# Altium schematic sheet Chess Clock Front Display SCH.SchDoc
size A3
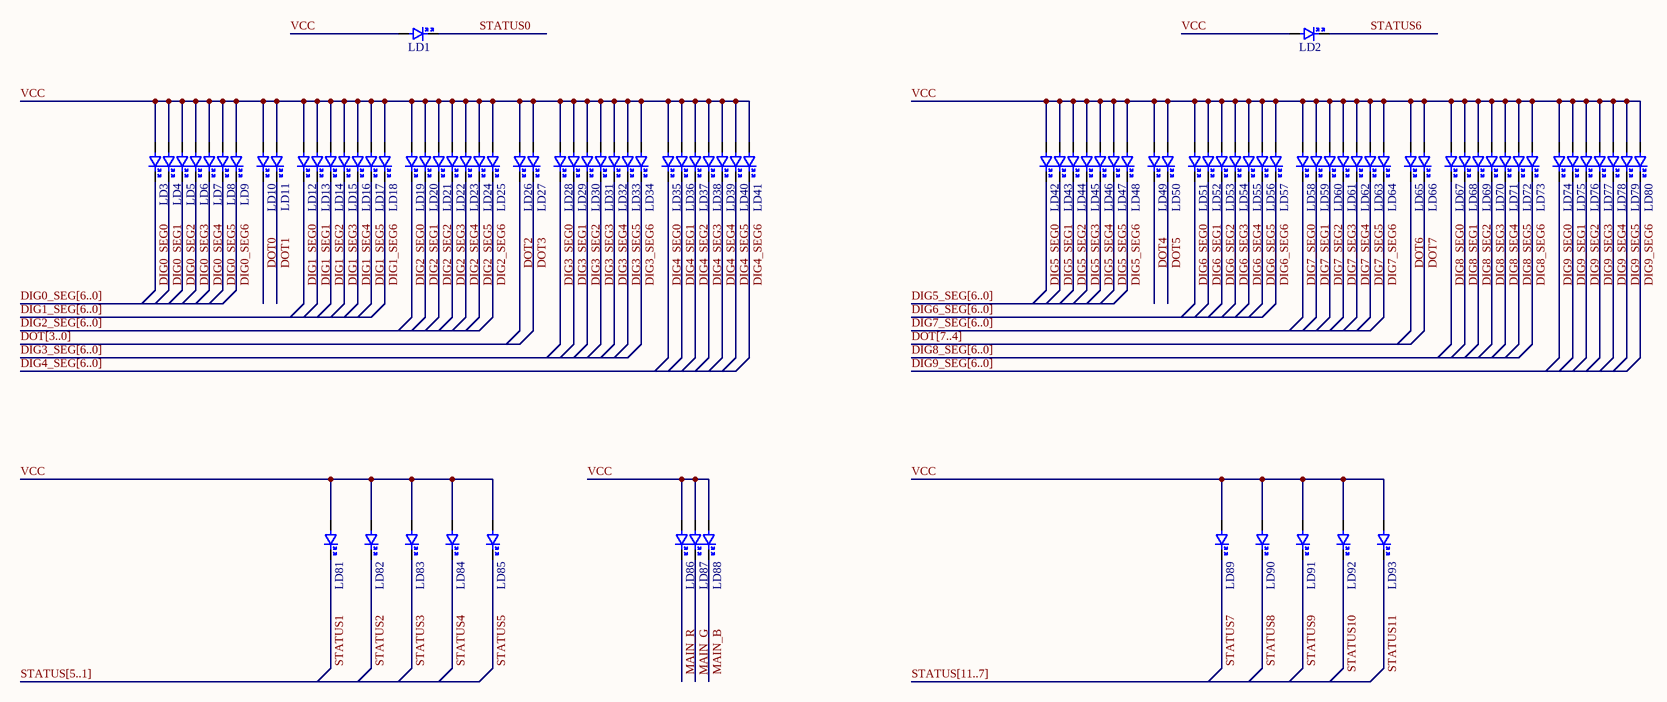
[diagram p0: Chess Clock Front Display SCH.SchDoc]

## Parts
LD1  LED 0603  [LED 0603]  (value not drawn)
LD2  LED 0603  [LED 0603]  (value not drawn)
LD3  LED 0603  [LED 0603]  (value not drawn)
LD4  LED 0603  [LED 0603]  (value not drawn)
LD5  LED 0603  [LED 0603]  (value not drawn)
LD6  LED 0603  [LED 0603]  (value not drawn)
LD7  LED 0603  [LED 0603]  (value not drawn)
LD8  LED 0603  [LED 0603]  (value not drawn)
LD9  LED 0603  [LED 0603]  (value not drawn)
LD10  LED 0603  [LED 0603]  (value not drawn)
LD11  LED 0603  [LED 0603]  (value not drawn)
LD12  LED 0603  [LED 0603]  (value not drawn)
LD13  LED 0603  [LED 0603]  (value not drawn)
LD14  LED 0603  [LED 0603]  (value not drawn)
LD15  LED 0603  [LED 0603]  (value not drawn)
LD16  LED 0603  [LED 0603]  (value not drawn)
LD17  LED 0603  [LED 0603]  (value not drawn)
LD18  LED 0603  [LED 0603]  (value not drawn)
LD19  LED 0603  [LED 0603]  (value not drawn)
LD20  LED 0603  [LED 0603]  (value not drawn)
LD21  LED 0603  [LED 0603]  (value not drawn)
LD22  LED 0603  [LED 0603]  (value not drawn)
LD23  LED 0603  [LED 0603]  (value not drawn)
LD24  LED 0603  [LED 0603]  (value not drawn)
LD25  LED 0603  [LED 0603]  (value not drawn)
LD26  LED 0603  [LED 0603]  (value not drawn)
LD27  LED 0603  [LED 0603]  (value not drawn)
LD28  LED 0603  [LED 0603]  (value not drawn)
LD29  LED 0603  [LED 0603]  (value not drawn)
LD30  LED 0603  [LED 0603]  (value not drawn)
LD31  LED 0603  [LED 0603]  (value not drawn)
LD32  LED 0603  [LED 0603]  (value not drawn)
LD33  LED 0603  [LED 0603]  (value not drawn)
LD34  LED 0603  [LED 0603]  (value not drawn)
LD35  LED 0603  [LED 0603]  (value not drawn)
LD36  LED 0603  [LED 0603]  (value not drawn)
LD37  LED 0603  [LED 0603]  (value not drawn)
LD38  LED 0603  [LED 0603]  (value not drawn)
LD39  LED 0603  [LED 0603]  (value not drawn)
LD40  LED 0603  [LED 0603]  (value not drawn)
LD41  LED 0603  [LED 0603]  (value not drawn)
LD42  LED 0603  [LED 0603]  (value not drawn)
LD43  LED 0603  [LED 0603]  (value not drawn)
LD44  LED 0603  [LED 0603]  (value not drawn)
LD45  LED 0603  [LED 0603]  (value not drawn)
LD46  LED 0603  [LED 0603]  (value not drawn)
LD47  LED 0603  [LED 0603]  (value not drawn)
LD48  LED 0603  [LED 0603]  (value not drawn)
LD49  LED 0603  [LED 0603]  (value not drawn)
LD50  LED 0603  [LED 0603]  (value not drawn)
LD51  LED 0603  [LED 0603]  (value not drawn)
LD52  LED 0603  [LED 0603]  (value not drawn)
LD53  LED 0603  [LED 0603]  (value not drawn)
LD54  LED 0603  [LED 0603]  (value not drawn)
LD55  LED 0603  [LED 0603]  (value not drawn)
LD56  LED 0603  [LED 0603]  (value not drawn)
LD57  LED 0603  [LED 0603]  (value not drawn)
LD58  LED 0603  [LED 0603]  (value not drawn)
LD59  LED 0603  [LED 0603]  (value not drawn)
LD60  LED 0603  [LED 0603]  (value not drawn)
LD61  LED 0603  [LED 0603]  (value not drawn)
LD62  LED 0603  [LED 0603]  (value not drawn)
LD63  LED 0603  [LED 0603]  (value not drawn)
LD64  LED 0603  [LED 0603]  (value not drawn)
LD65  LED 0603  [LED 0603]  (value not drawn)
LD66  LED 0603  [LED 0603]  (value not drawn)
LD67  LED 0603  [LED 0603]  (value not drawn)
LD68  LED 0603  [LED 0603]  (value not drawn)
LD69  LED 0603  [LED 0603]  (value not drawn)
LD70  LED 0603  [LED 0603]  (value not drawn)
LD71  LED 0603  [LED 0603]  (value not drawn)
LD72  LED 0603  [LED 0603]  (value not drawn)
LD73  LED 0603  [LED 0603]  (value not drawn)
LD74  LED 0603  [LED 0603]  (value not drawn)
LD75  LED 0603  [LED 0603]  (value not drawn)
LD76  LED 0603  [LED 0603]  (value not drawn)
LD77  LED 0603  [LED 0603]  (value not drawn)
LD78  LED 0603  [LED 0603]  (value not drawn)
LD79  LED 0603  [LED 0603]  (value not drawn)
LD80  LED 0603  [LED 0603]  (value not drawn)
LD81  LED 0603  [LED 0603]  (value not drawn)
LD82  LED 0603  [LED 0603]  (value not drawn)
LD83  LED 0603  [LED 0603]  (value not drawn)
LD84  LED 0603  [LED 0603]  (value not drawn)
LD85  LED 0603  [LED 0603]  (value not drawn)
LD86  LED 0603  [LED 0603]  (value not drawn)
LD87  LED 0603  [LED 0603]  (value not drawn)
LD88  LED 0603  [LED 0603]  (value not drawn)
LD89  LED 0603  [LED 0603]  (value not drawn)
LD90  LED 0603  [LED 0603]  (value not drawn)
LD91  LED 0603  [LED 0603]  (value not drawn)
LD92  LED 0603  [LED 0603]  (value not drawn)
LD93  LED 0603  [LED 0603]  (value not drawn)

## Nets
DIG0_SEG0: LD3.2
DIG0_SEG1: LD4.2
DIG0_SEG2: LD5.2
DIG0_SEG3: LD6.2
DIG0_SEG4: LD7.2
DIG0_SEG5: LD8.2
DIG0_SEG6: LD9.2
DIG1_SEG0: LD12.2
DIG1_SEG1: LD13.2
DIG1_SEG2: LD14.2
DIG1_SEG3: LD15.2
DIG1_SEG4: LD16.2
DIG1_SEG5: LD17.2
DIG1_SEG6: LD18.2
DIG2_SEG0: LD19.2
DIG2_SEG1: LD20.2
DIG2_SEG2: LD21.2
DIG2_SEG3: LD22.2
DIG2_SEG4: LD23.2
DIG2_SEG5: LD24.2
DIG2_SEG6: LD25.2
DIG3_SEG0: LD28.2
DIG3_SEG1: LD29.2
DIG3_SEG2: LD30.2
DIG3_SEG3: LD31.2
DIG3_SEG4: LD32.2
DIG3_SEG5: LD33.2
DIG3_SEG6: LD34.2
DIG4_SEG0: LD35.2
DIG4_SEG1: LD36.2
DIG4_SEG2: LD37.2
DIG4_SEG3: LD38.2
DIG4_SEG4: LD39.2
DIG4_SEG5: LD40.2
DIG4_SEG6: LD41.2
DIG5_SEG0: LD42.2
DIG5_SEG1: LD43.2
DIG5_SEG2: LD44.2
DIG5_SEG3: LD45.2
DIG5_SEG4: LD46.2
DIG5_SEG5: LD47.2
DIG5_SEG6: LD48.2
DIG6_SEG0: LD51.2
DIG6_SEG1: LD52.2
DIG6_SEG2: LD53.2
DIG6_SEG3: LD54.2
DIG6_SEG4: LD55.2
DIG6_SEG5: LD56.2
DIG6_SEG6: LD57.2
DIG7_SEG0: LD58.2
DIG7_SEG1: LD59.2
DIG7_SEG2: LD60.2
DIG7_SEG3: LD61.2
DIG7_SEG4: LD62.2
DIG7_SEG5: LD63.2
DIG7_SEG6: LD64.2
DIG8_SEG0: LD67.2
DIG8_SEG1: LD68.2
DIG8_SEG2: LD69.2
DIG8_SEG3: LD70.2
DIG8_SEG4: LD71.2
DIG8_SEG5: LD72.2
DIG8_SEG6: LD73.2
DIG9_SEG0: LD74.2
DIG9_SEG1: LD75.2
DIG9_SEG2: LD76.2
DIG9_SEG3: LD77.2
DIG9_SEG4: LD78.2
DIG9_SEG5: LD79.2
DIG9_SEG6: LD80.2
DOT0: LD10.2
DOT1: LD11.2
DOT2: LD26.2
DOT3: LD27.2
DOT4: LD49.2
DOT5: LD50.2
DOT6: LD65.2
DOT7: LD66.2
MAIN_B: LD88.2
MAIN_G: LD87.2
MAIN_R: LD86.2
STATUS0: LD1.2
STATUS1: LD81.2
STATUS2: LD82.2
STATUS3: LD83.2
STATUS4: LD84.2
STATUS5: LD85.2
STATUS6: LD2.2
STATUS7: LD89.2
STATUS8: LD90.2
STATUS9: LD91.2
STATUS10: LD92.2
STATUS11: LD93.2
VCC: LD1.1 LD2.1 LD3.1 LD4.1 LD5.1 LD6.1 LD7.1 LD8.1 LD9.1 LD10.1 LD11.1 LD12.1 LD13.1 LD14.1 LD15.1 LD16.1 LD17.1 LD18.1 LD19.1 LD20.1 LD21.1 LD22.1 LD23.1 LD24.1 LD25.1 LD26.1 LD27.1 LD28.1 LD29.1 LD30.1 LD31.1 LD32.1 LD33.1 LD34.1 LD35.1 LD36.1 LD37.1 LD38.1 LD39.1 LD40.1 LD41.1 LD42.1 LD43.1 LD44.1 LD45.1 LD46.1 LD47.1 LD48.1 LD49.1 LD50.1 LD51.1 LD52.1 LD53.1 LD54.1 LD55.1 LD56.1 LD57.1 LD58.1 LD59.1 LD60.1 LD61.1 LD62.1 LD63.1 LD64.1 LD65.1 LD66.1 LD67.1 LD68.1 LD69.1 LD70.1 LD71.1 LD72.1 LD73.1 LD74.1 LD75.1 LD76.1 LD77.1 LD78.1 LD79.1 LD80.1 LD81.1 LD82.1 LD83.1 LD84.1 LD85.1 LD86.1 LD87.1 LD88.1 LD89.1 LD90.1 LD91.1 LD92.1 LD93.1

## Buses and harness runs
bus DIG0_SEG[6..0]
bus DIG1_SEG[6..0]
bus DIG2_SEG[6..0]
bus DIG3_SEG[6..0]
bus DIG4_SEG[6..0]
bus DIG5_SEG[6..0]
bus DIG6_SEG[6..0]
bus DIG7_SEG[6..0]
bus DIG8_SEG[6..0]
bus DIG9_SEG[6..0]
bus DOT[3..0]
bus DOT[7..4]
bus STATUS[5..1]
bus STATUS[11..7]

## Library data of the parts
LD1-LD93 = LED 0603: Categories: LED; Manufacturer: -; Manufacturer Part Number: -; Package: 0603; Supplier 1: Digi-Key; Supplier 2: LCSC; Supplier Part Number 1: -; Supplier Part Number 2: -